# Altium project funny_car.PrjPCB
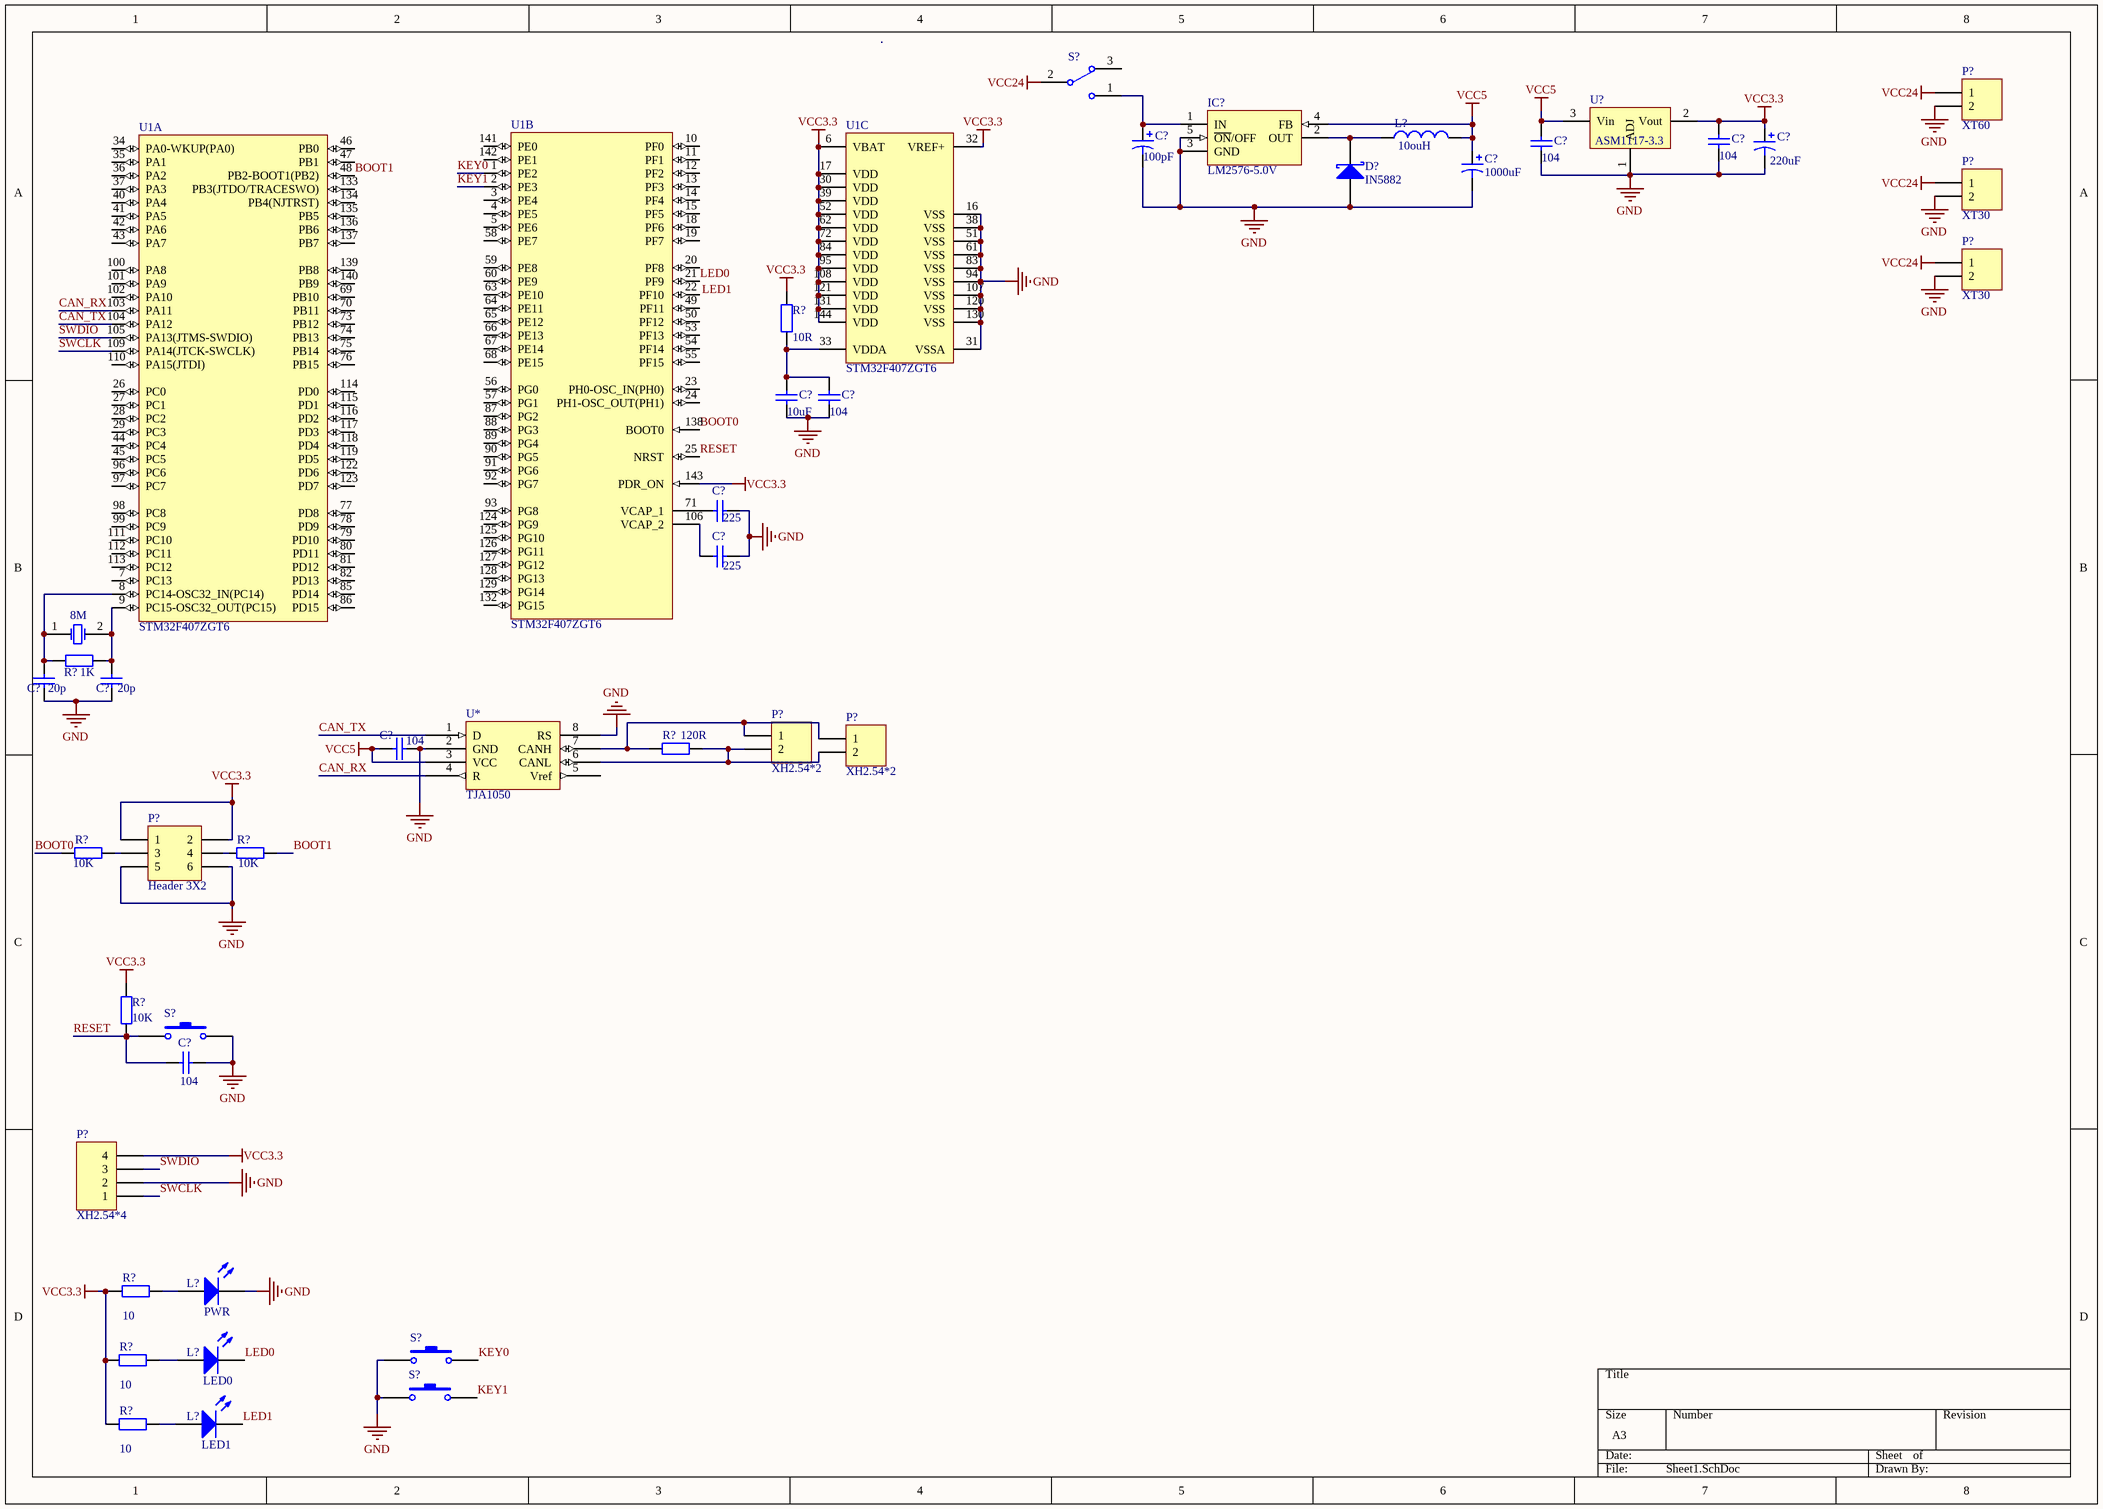
[diagram p0: Sheet1.SchDoc]
1 sheet, 43 parts. Net scope: global (net labels, ports and power ports of the same name join across sheets).
Board file: PCB1.PcbDoc

## Sheet Sheet1.SchDoc
size A3

### Parts
(Parts that share a designator on the sheet are numbered #1, #2 ... from top to bottom, then left to right.)
8M  XTAL  [XTAL-QC49/SMD]  (value not drawn)
C?#1  value 100pF  [RB7.6-15]  (hidden comment: Cap Pol1)
C?#2  value 220uF  [C6032]
C?#3  value 104  [0805C]
C?#4  value 104  [0805C]
C?#5  value 1000uF  [RB7.6-15]  (hidden comment: Cap Pol1)
C?#6  value 10uF  [0805C]
C?#7  value 104  [0805C]
C?#8  value 225  [0805C]
C?#9  value 225  [0805C]
C?#10  value 20p  [RAD-0.3]  (hidden comment: Cap)
C?#11  value 20p  [RAD-0.3]  (hidden comment: Cap)
C?#12  value 104  [0805C]
C?#13  value 104  [0805C]
D?  IN5882  [TO-220AC]
IC?  LM2576-5.0V  [TO220-5B]
L?#1  value 10ouH  [0402-A]  (hidden comment: Inductor)
L?#2  PWR  [LED0805]
L?#3  LED0  [LED0805]
L?#4  LED1  [LED0805]
P?#1  XT60  [XT60H-M]
P?#2  XT30  [XT60H-M]
P?#3  XT30  [XT60H-M]
P?#4  XH2.54*2  [XH2.54-2]
P?#5  XH2.54*2  [XH2.54-2]
P?#6  Header 3X2  [HDR2X3]
P?#7  XH2.54*4  [XH2.54-4]
R?#1  value 10R  [0805R]
R?#2  value 1K  [AXIAL-0.4]  (hidden comment: Res2)
R?#3  value 120R  [0805R]
R?#4  value 10K  [0805R]
R?#5  value 10K  [0805R]
R?#6  value 10K  [0805R]
R?#7  value 10  [0805R]
R?#8  value 10  [0805R]
R?#9  value 10  [0805R]
S?#1  开关  [拨动开关]  (value not drawn)
S?#2  (no value)  [TSW DIP-6*6*5]
S?#3  (no value)  [TSW DIP-6*6*5]
S?#4  (no value)  [TSW DIP-6*6*5]
U1  STM32F407ZGT6  [STM-LQFP144_N]  (parts A,B,C of 3)
U*  TJA1050  [SOP8_N]
U?  ASM1117-3.3  [SOT223]

### Nets
GND: C?#1.2 C?#2.2 C?#3.1 C?#4.1 C?#5.2 C?#6.1 C?#7.1 C?#8.1 C?#9.2 C?#10.1 C?#11.1 C?#12.1 C?#13.1 D?.3(A) IC?.3(GND) IC?.5(~{ON}/OFF) L?#2.2(K) P?#1.2 P?#2.2 P?#3.2 P?#6.5 P?#6.6 P?#7.2 S?#2.2 S?#3.1 S?#4.1 U1.16(VSS) U1.31(VSSA) U1.38(VSS) U1.51(VSS) U1.61(VSS) U1.83(VSS) U1.94(VSS) U1.107(VSS) U1.120(VSS) U1.130(VSS) U*.2(GND) U*.8(RS) U?.1(ADJ)
VCC3.3: C?#2.1 C?#4.2 P?#6.1 P?#6.2 P?#7.4 R?#1.1 R?#6.1 R?#7.1 R?#8.1 R?#9.1 U1.6(VBAT) U1.17(VDD) U1.30(VDD) U1.32(VREF+) U1.39(VDD) U1.52(VDD) U1.62(VDD) U1.72(VDD) U1.84(VDD) U1.95(VDD) U1.108(VDD) U1.121(VDD) U1.131(VDD) U1.143(PDR_ON) U1.144(VDD) U?.2(Vout)
VCC5: C?#3.2 C?#5.1 C?#12.2 IC?.4(FB) L?#1.2 U*.3(VCC) U?.3(Vin)
VCC24: P?#1.1 P?#2.1 P?#3.1 S?#1.2
BOOT0: R?#4.1 U1.138(BOOT0)
BOOT1: R?#5.2 U1.48(PB2-BOOT1(PB2))
CAN_RX: U1.103(PA11) U*.4(R)
CAN_TX: U1.104(PA12) U*.1(D)
KEY0: S?#3.2 U1.1(PE2)
KEY1: S?#4.2 U1.2(PE3)
LED0: L?#3.2(K) U1.21(PF9)
LED1: L?#4.2(K)
RESET: C?#13.2 R?#6.2 S?#2.1 U1.25(NRST)
SWCLK: P?#7.1 U1.109(PA14(JTCK-SWCLK))
SWDIO: P?#7.3 U1.105(PA13(JTMS-SWDIO))
Net8M_1: 8M.1(OSC1) C?#10.2 R?#2.2 U1.8(PC14-OSC32_IN(PC14))
Net8M_2: 8M.2(OSC2) C?#11.2 R?#2.1 U1.9(PC15-OSC32_OUT(PC15))
NetC?#1_1: C?#1.1 IC?.1(IN) S?#1.1
NetC?#6_2: C?#6.2 C?#7.2 R?#1.2 U1.33(VDDA)
NetC?#8_2: C?#8.2 U1.71(VCAP_1)
NetC?#9_1: C?#9.1 U1.106(VCAP_2)
NetD?_1: D?.1(K) IC?.2(OUT) L?#1.1
NetL?#2_1: L?#2.1(A) R?#7.2
NetL?#3_1: L?#3.1(A) R?#8.2
NetL?#4_1: L?#4.1(A) R?#9.2
NetP?#4_1: P?#4.1 P?#5.1 R?#3.1 U*.7(CANH)
NetP?#4_2: P?#4.2 P?#5.2 R?#3.2 U*.6(CANL)
NetP?#6_3: P?#6.3 R?#4.2
NetP?#6_4: P?#6.4 R?#5.1

Not connected (* = marked no-connect by the designer): S?#1 3; U1 3(PE4) 4(PE5) 5(PE6) 7(PC13) 10(PF0) 11(PF1) 12(PF2) 13(PF3) 14(PF4) 15(PF5) 18(PF6) 19(PF7) 20(PF8) 22(PF10) 23(PH0-OSC_IN(PH0)) 24(PH1-OSC_OUT(PH1)) 26(PC0) 27(PC1) 28(PC2) 29(PC3) 34(PA0-WKUP(PA0)) 35(PA1) 36(PA2) 37(PA3) 40(PA4) 41(PA5) 42(PA6) 43(PA7) 44(PC4) 45(PC5) 46(PB0) 47(PB1) 49(PF11) 50(PF12) 53(PF13) 54(PF14) 55(PF15) 56(PG0) 57(PG1) 58(PE7) 59(PE8) 60(PE9) 63(PE10) 64(PE11) 65(PE12) 66(PE13) 67(PE14) 68(PE15) 69(PB10) 70(PB11) 73(PB12) 74(PB13) 75(PB14) 76(PB15) 77(PD8) 78(PD9) 79(PD10) 80(PD11) 81(PD12) 82(PD13) 85(PD14) 86(PD15) 87(PG2) 88(PG3) 89(PG4) 90(PG5) 91(PG6) 92(PG7) 93(PG8) 96(PC6) 97(PC7) 98(PC8) 99(PC9) 100(PA8) 101(PA9) 102(PA10) 110(PA15(JTDI)) 111(PC10) 112(PC11) 113(PC12) 114(PD0) 115(PD1) 116(PD2) 117(PD3) 118(PD4) 119(PD5) 122(PD6) 123(PD7) 124(PG9) 125(PG10) 126(PG11) 127(PG12) 128(PG13) 129(PG14) 132(PG15) 133(PB3(JTDO/TRACESWO)) 134(PB4(NJTRST)) 135(PB5) 136(PB6) 137(PB7) 139(PB8) 140(PB9) 141(PE0) 142(PE1); U* 5(Vref)

### Notes on the sheet
- Labels drawn without touching a wire or pin: LED1

### Library data of the parts
8M = XTAL: Crystal Oscillator; Published: 8-Jun-2000; LatestRevisionDate: 17-Jul-2002; LatestRevisionNote: Re-released for DXP Platform.; PackageReference: R38; Publisher: Altium Limited; PackageDescription: Crystal, Thru-Hole; 2 Leads; Body 3.1 x 8.2 mm (Dia.xH)
C?#1 C?#2 C?#5 = Cap Pol1: Polarized Capacitor (Radial); Published: 8-Jun-2000; LatestRevisionDate: 17-Jul-2002; LatestRevisionNote: Re-released for DXP Platform.; PackageReference: RB7.6-15; Publisher: Altium Limited; PackageDescription: Polarized Capacitor (Radial); 2 Leads
C?#3 C?#4 C?#6-C?#13 = Cap: Capacitor; Published: 8-Jun-2000; LatestRevisionDate: 17-Jul-2002; LatestRevisionNote: Re-released for DXP Platform.; PackageReference: RAD-0.3; Publisher: Altium Limited; PackageDescription: Radial Cap, Thru-Hole; 2 Leads; 0.3 in Pin Spacing
D? = Diode 10TQ035: Schottky Rectifier; Note: Terminal 2 is the TAB and is electrically connected to the cathode; Published: 8-Jun-2000; LatestRevisionDate: 17-Jul-2002; LatestRevisionNote: Re-released for DXP Platform.; DatasheetVersion: PD-2.057B; PackageVersion: Feb-1998; PackageReference: TO-220AC; Publisher: Altium Limited; PackageDescription: TO, Thru-Hole, Vertical, Heatsink Mounted; 3 In-Line Leads (1 Absent); Pitch 2.54 mm; ComponentLink1Description: Manufacturer Link; ComponentLink1URL: http://www.irf.com/; ComponentLink2Description: Datasheet; ComponentLink2URL: http://www.irf.com/product-info/datasheets/data/10tq.pdf
IC? = LM2576: DC降压芯片; 试用产品: 如您满意请支持正品; BOM名称: DC降压芯片; 学习资源: www.ooocke.com
L?#1 = Inductor: Code_IEC: 1005; Published: 8-Jun-2000; LatestRevisionDate: 29-May-2009; LatestRevisionNote: IPC-7351 Footprint Added.; PackageReference: 0402-A; Publisher: Altium Limited; PackageDescription: Chip Inductor; Code_JEITA: 0402
L?#2-L?#4 = LED
P?#1-P?#5 = Header 2: Header, 2-Pin; LatestRevisionDate: 17-Jul-2002; LatestRevisionNote: Re-released for DXP Platform.; Publisher: Altium Limited
P?#6 = Header 3X2: Header, 3-Pin, Dual row; LatestRevisionDate: 17-Jul-2002; LatestRevisionNote: Re-released for DXP Platform.; Publisher: Altium Limited
P?#7 = Header 4: Header, 4-Pin; LatestRevisionDate: 17-Jul-2002; LatestRevisionNote: Re-released for DXP Platform.; Publisher: Altium Limited
R?#1-R?#9 = Res2: Resistor; Published: 8-Jun-2000; LatestRevisionDate: 17-Jul-2002; LatestRevisionNote: Re-released for DXP Platform.; PackageReference: AXIAL-0.4; Publisher: Altium Limited; PackageDescription: Axial Device, Thru-Hole; 2 Leads; 0.4 in Pin Spacing
S?#1 = 拨动开关（三脚）
S?#2-S?#4 = SW-PB: Switch; Published: 24-Mar-1999; LatestRevisionDate: 17-Jul-2002; LatestRevisionNote: Re-released for DXP Platform.; PackageReference: SPST-2; Publisher: Altium Limited; PackageDescription: Switch; 2 Leads
U1 = STM32F407ZGT6: ARM Cortex-M4 32-bit MCU+FPU, 210 DMIPS, 1024 kB Flash, 192 kB Internal RAM, 114 I/Os, 144-pin LQFP, -40 to 85 degC, Tray; Manufacturer: STMicroelectronics; D/A Converter: 2x12-bit; FLASH Size (Prog) (kB): 1024; I/Os (High Current): 114; Internal RAM Size (kB): 192; Operating Frequency(F) (Processor speed) (MHz): 168; Supply Voltage(Vcc) max (V): 3.6; Supply Voltage(Vcc) min (V): 1.8; DatasheetVersion: Rev. 4; PackageVersion: Rev. 4, 06/2013; PackageReference: LQFP144; PackageDescription: 144-Pin Low Profile Quad Flat Package, 20 x 20 mm Body, 0.5 mm Pitch; Supplier 1: Digi-Key; Supplier Part Number 1: 497-11766-ND; Supplier 2: Newark; Supplier Part Number 2: 73T2334; Supplier 3: Mouser; Supplier Part Number 3: 511-STM32F407ZGT6; Core: ARM Cortex-M4; Packing: Tray; Mounting Technology: Surface Mount; PartNumber: STM32F407ZGT6; ComponentLink1Description: Manufacturer URL; ComponentLink1URL: http://www.st.com/web/en/home.html; ComponentLink2Description: Datasheet; ComponentLink2URL: http://www.st.com/st-web-ui/static/active/en/resource/technical/document/datasheet/DM00037051.pdf; ComponentLink3Description: Package Specification; ComponentLink3URL: http://www.st.com/st-web-ui/static/active/en/resource/technical/document/datasheet/DM00037051.pdf
U* = 24CL256
U? = LM317: 3-Terminal Adjustable Positive Voltage Regulator